# EasyEDA Pro project ProPrj_Hitboard PCB v2_2026-01-15.epro

# Board PCB1
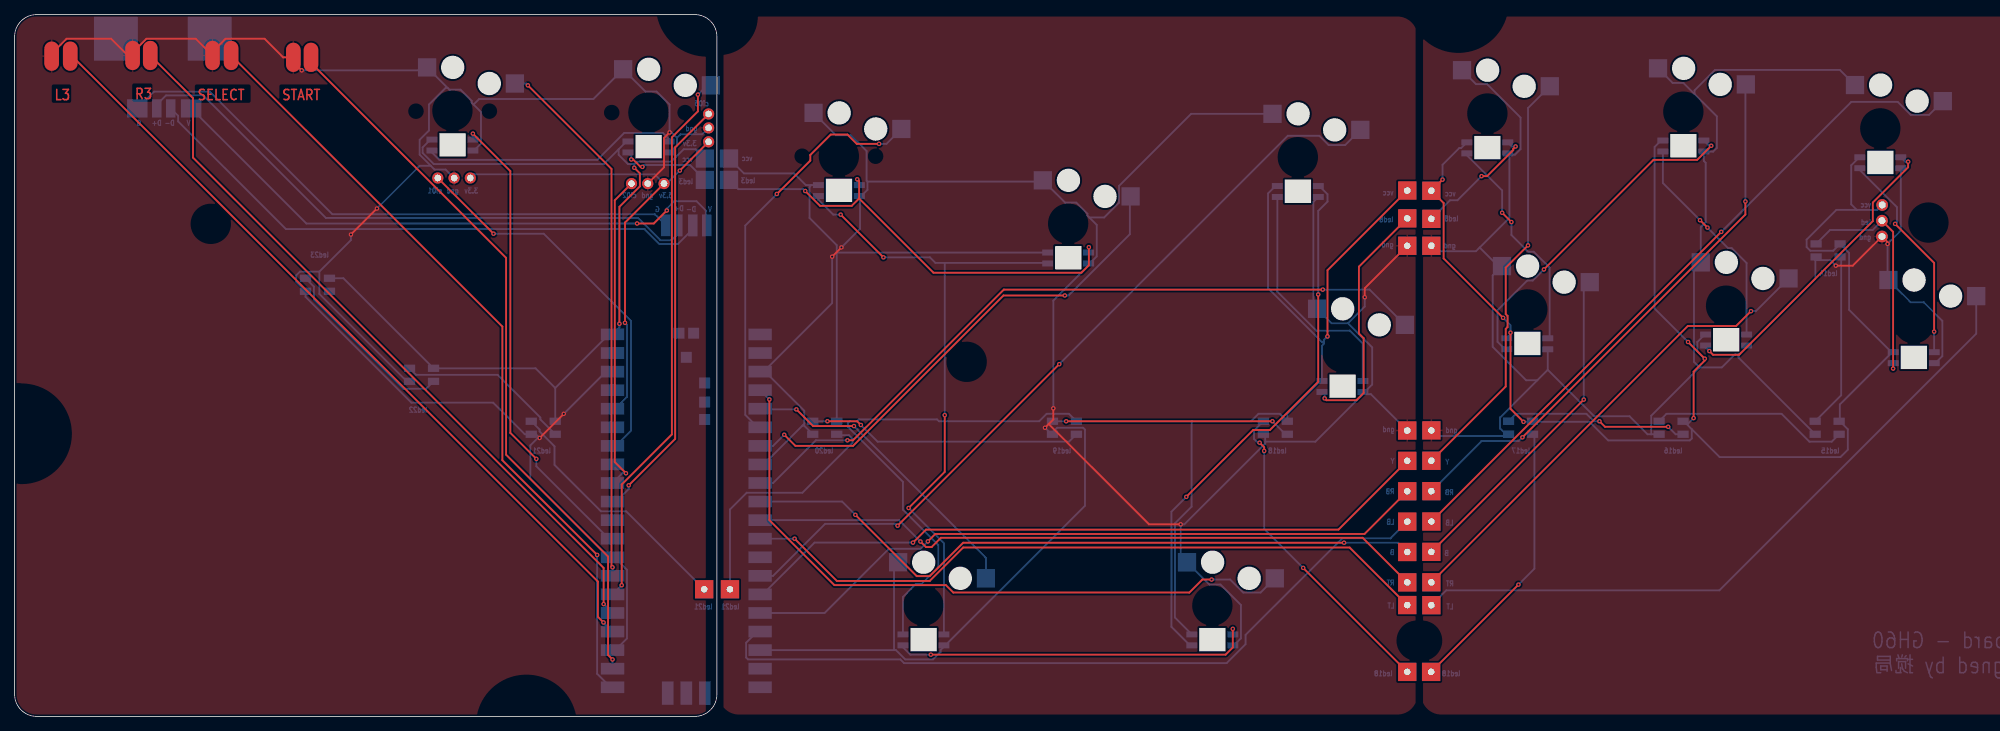
[diagram p0: board, top side]
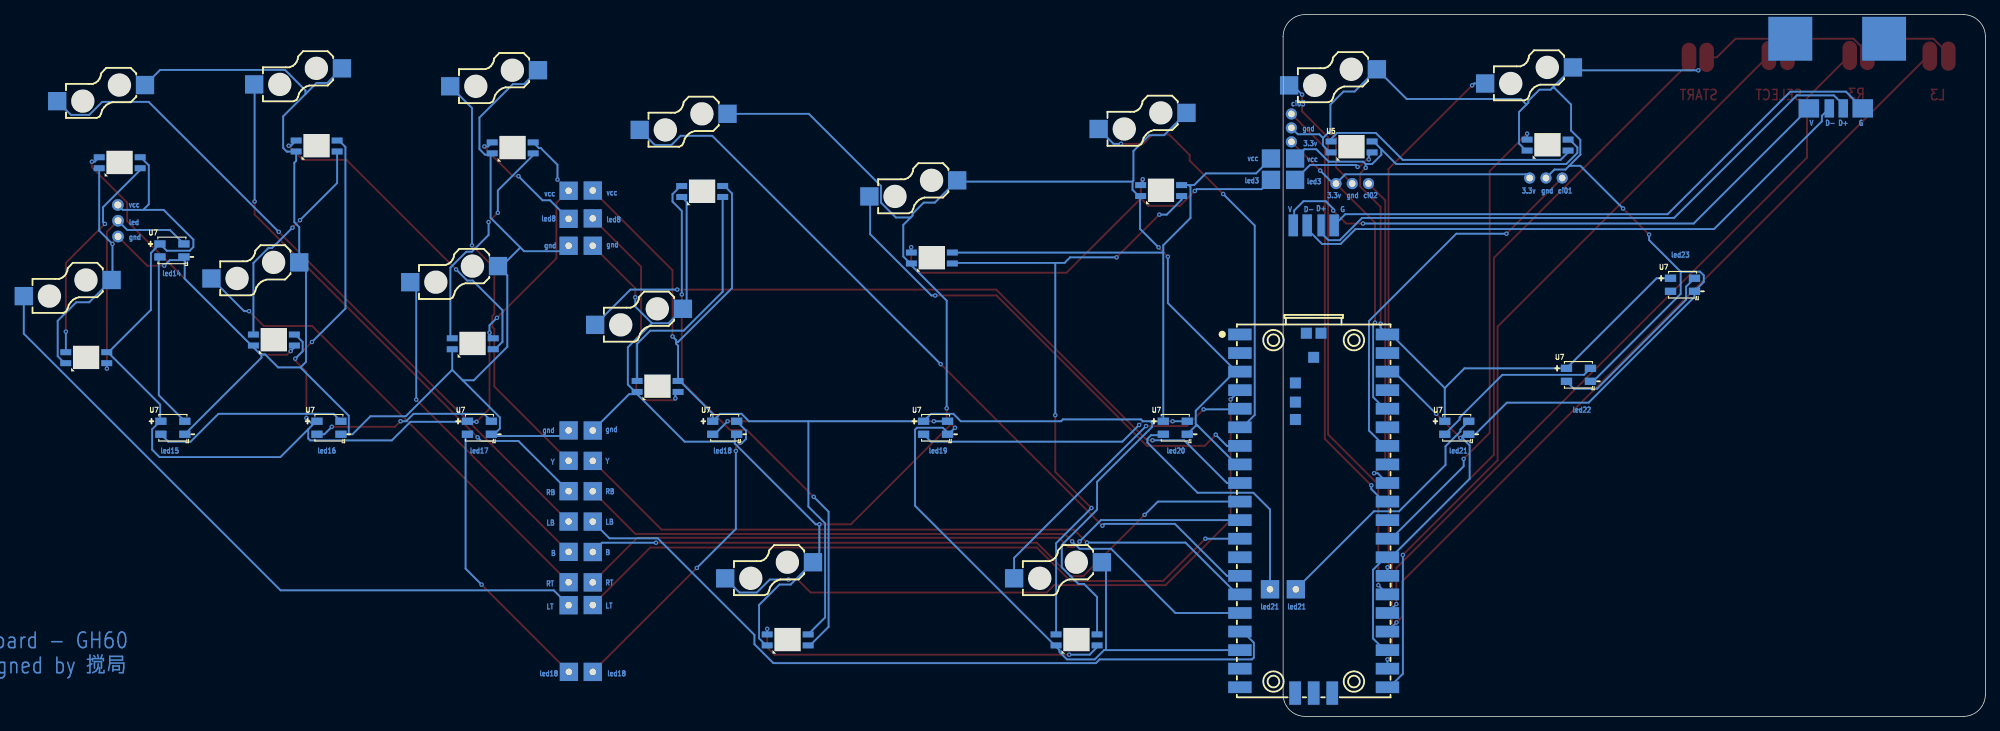
[diagram p1: board, bottom side, seen from below]

Outline 266.25 x 96 mm; copper layers: Top Layer, Bottom Layer. Coordinates in mm from the lower left corner of the outline.
Outline path: 0,93 0,3 arc(0.88,0.88) 3,0 93,0 arc(95.12,0.88) 96,3 96,93 arc(95.12,95.12) 93,96 3,96 arc(0.88,95.12) 0,93
Stack: Top Layer 0.035mm / Dielectric1 1.51mm FR4 er 4.5 / Bottom Layer 0.035mm

## Design rules (mm)
template: JLCPCB Capability(Two Layers Board)
spacing copperThickness1oz (default): track to track 0.102, other pairs 0.152 to 0.3
spacing copperThickness2oz: track to track 0.203, other pairs 0.152 to 0.3
track width copperThickness1oz (default): min 0.127, default 0.254, max 2.54
track width copperThickness2oz: min 0.203, default 0.254, max 2.54
differential pair differentialPair (default): width min 0.127, default 0.254, max 2.54; gap min 0.152, default 0.152
via viaSize (default): diameter min 0.5, default 0.61, max 10; hole min 0.3, default 0.305, max 6.3

## Placement (name value [footprint] x y rotation side)
NOREF  -  [Pad_e68]  193.68 39.12 0 top
NOREF#2  -  [Pad_e301]  94.87 82.41 0 top
NOREF#3  -  [Pad_e299]  94.87 78.6 0 top
NOREF#4  -  [Pad_e13637]  193.68 71.9 0 top
NOREF#5  -  [Pad_e675]  5.06 90.32 0 top
NOREF#6  -  [Pad_e296]  60.07 73.65 0 top
NOREF#7  -  [Pad_e691]  90.81 67.17 180 top
NOREF#8  -  [Pad_e61148]  255.27 65.65 0 top
NOREF#9  -  [Pad_e13607]  190.37 18.33 0 top
NOREF#10  -  [Pad_e13608]  190.37 15.23 0 top
NOREF#11  -  [Pad_e70]  193.68 30.81 0 top
NOREF#12  -  [Pad_e681]  38.1 90.16 0 top
NOREF#13  -  [Pad_e676]  7.6 90.32 0 top
NOREF#14  -  [Pad_e13601]  190.37 68.12 0 top
NOREF#15  -  [Pad_e4875]  193.64 6.08 0 top
NOREF#16  -  [Pad_e4877]  190.37 6.08 0 top
NOREF#17  -  [Pad_e682]  40.51 90.16 0 top
NOREF#18  -  [Pad_e6738]  94.36 73.39 0 top
NOREF#19  -  [Pad_e678]  18.54 90.41 0 top
NOREF#20  -  [Pad_e53994]  26.67 92.7 180 top
NOREF#21  -  [Pad_e679]  27.05 90.41 0 top
NOREF#22  -  [Pad_e694]  94.61 67.17 180 top
NOREF#23  -  [Pad_e61147]  255.27 67.81 0 top
NOREF#24  -  [Pad_e46]  88.77 72.89 0 top
NOREF#25  -  [Pad_e687]  97.66 76.31 0 top
NOREF#26  -  [Pad_e685]  21.34 83.17 180 top
NOREF#27  -  [Pad_e69]  193.68 34.97 0 top
NOREF#28  -  [Pad_e61146]  255.3 69.97 0 top
NOREF#29  -  [Pad_e13603]  190.37 34.95 0 top
NOREF#30  -  [Pad_e6737]  97.66 73.39 0 top
NOREF#31  -  [Pad_e13606]  190.37 22.49 0 top
NOREF#32  -  [Pad_e13636]  193.68 64.38 0 top
NOREF#33  -  [Pad_e684]  19.43 83.17 180 top
NOREF#34  -  [Pad_e680]  29.59 90.41 0 top
NOREF#35  -  [Pad_e297]  57.85 73.65 0 top
NOREF#36  -  [Pad_e300]  94.87 80.51 0 top
NOREF#37  -  [Pad_e677]  16.13 90.41 0 top
NOREF#38  -  [Pad_e693]  92.71 67.17 180 top
NOREF#39  -  [Pad_e294]  86.55 72.89 0 top
NOREF#40  -  [Pad_e683]  16.76 83.17 180 top
NOREF#41  -  [Pad_e72]  193.68 22.5 0 top
NOREF#42  -  [Pad_e13635]  193.68 68.06 0 top
NOREF#43  -  [Pad_e4881]  97.79 17.39 0 top
NOREF#44  -  [Pad_e13605]  190.37 26.64 0 top
NOREF#45  -  [Pad_e71]  193.68 26.66 0 top
NOREF#46  -  [Pad_e4879]  94.26 17.39 0 top
NOREF#47  -  [Pad_e73]  193.68 18.35 0 top
NOREF#48  -  [Pad_e13600]  190.37 71.93 0 top
NOREF#49  -  [Pad_e6736]  94.36 76.31 0 top
NOREF#50  -  [Pad_e53995]  13.84 92.7 180 top
NOREF#51  -  [Pad_e48]  84.33 72.89 0 top
NOREF#52  -  [Pad_e295]  62.29 73.65 0 top
NOREF#53  -  [Pad_e13604]  190.37 30.8 0 top
NOREF#54  -  [Pad_e114539]  190.37 39.1 0 top
NOREF#55  -  [Pad_e689]  89.03 67.17 180 top
NOREF#56  -  [Pad_e74]  193.68 15.21 0 top
NOREF#57  -  [Pad_e13602]  190.37 64.38 0 top
NOREF#58  -  [Pad_e686]  24.13 83.17 180 top
U1  PICO  [COMM-SMD_L51.0-W21.0-P2.54_SC0916]  91.82 27.8 270 bottom
U5  -  [LED-SMD_L3.2-W2.8_YO-WS2812B-3528]  144.02 62.7 180 bottom
U5#2  -  [LED-SMD_L3.2-W2.8_YO-WS2812B-3528]  59.84 78.15 180 bottom
U5#3  -  [LED-SMD_L3.2-W2.8_YO-WS2812B-3528]  86.64 77.9 180 bottom
U5#4  -  [LED-SMD_L3.2-W2.8_YO-WS2812B-3528]  112.68 71.93 180 bottom
U5#5  -  [LED-SMD_L3.2-W2.8_YO-WS2812B-3528]  124.23 10.46 180 bottom
U5#6  -  [LED-SMD_L3.2-W2.8_YO-WS2812B-3528]  163.73 10.46 180 bottom
U5#7  -  [LED-SMD_L3.2-W2.8_YO-WS2812B-3528]  175.41 71.8 180 bottom
U5#8  -  [LED-SMD_L3.2-W2.8_YO-WS2812B-3528]  181.51 45.13 180 bottom
U5#9  -  [LED-SMD_L3.2-W2.8_YO-WS2812B-3528]  201.32 77.77 180 bottom
U5#10  -  [LED-SMD_L3.2-W2.8_YO-WS2812B-3528]  206.78 50.97 180 bottom
U5#11  -  [LED-SMD_L3.2-W2.8_YO-WS2812B-3528]  228.12 78.03 180 bottom
U5#12  -  [LED-SMD_L3.2-W2.8_YO-WS2812B-3528]  233.96 51.48 180 bottom
U5#13  -  [LED-SMD_L3.2-W2.8_YO-WS2812B-3528]  255.04 75.74 180 bottom
U5#14  -  [LED-SMD_L3.2-W2.8_YO-WS2812B-3528]  259.62 49.07 180 bottom
U6  -  [CONN-SMD_HOTPLUGPAKAGE__C9900010116-1]  146.56 72.23 180 bottom
U6#2  -  [CONN-SMD_HOTPLUGPAKAGE__C9900010116-1]  62.38 87.68 180 bottom
U6#3  -  [CONN-SMD_HOTPLUGPAKAGE__C9900010116-1]  89.18 87.42 180 bottom
U6#4  -  [CONN-SMD_HOTPLUGPAKAGE__C9900010116-1]  115.22 81.45 180 bottom
U6#5  -  [CONN-SMD_HOTPLUGPAKAGE__C9900010116-1]  126.77 19.99 180 bottom
U6#6  -  [CONN-SMD_HOTPLUGPAKAGE__C9900010116-1]  166.27 19.99 180 bottom
U6#7  -  [CONN-SMD_HOTPLUGPAKAGE__C9900010116-1]  177.95 81.33 180 bottom
U6#8  -  [CONN-SMD_HOTPLUGPAKAGE__C9900010116-1]  184.05 54.66 180 bottom
U6#9  -  [CONN-SMD_HOTPLUGPAKAGE__C9900010116-1]  203.86 87.3 180 bottom
U6#10  -  [CONN-SMD_HOTPLUGPAKAGE__C9900010116-1]  209.32 60.5 180 bottom
U6#11  -  [CONN-SMD_HOTPLUGPAKAGE__C9900010116-1]  230.66 87.55 180 bottom
U6#12  -  [CONN-SMD_HOTPLUGPAKAGE__C9900010116-1]  236.5 61.01 180 bottom
U6#13  -  [CONN-SMD_HOTPLUGPAKAGE__C9900010116-1]  257.58 85.27 180 bottom
U6#14  -  [CONN-SMD_HOTPLUGPAKAGE__C9900010116-1]  262.16 58.59 180 bottom
U7  -  [LED-SMD_4P-L3.5-W3.5-TL_WS2812B]  72.26 39.48 180 bottom
U7#2  -  [LED-SMD_4P-L3.5-W3.5-TL_WS2812B]  247.9 63.74 180 bottom
U7#3  -  [LED-SMD_4P-L3.5-W3.5-TL_WS2812B]  247.78 39.48 180 bottom
U7#4  -  [LED-SMD_4P-L3.5-W3.5-TL_WS2812B]  226.44 39.48 180 bottom
U7#5  -  [LED-SMD_4P-L3.5-W3.5-TL_WS2812B]  205.87 39.48 180 bottom
U7#6  -  [LED-SMD_4P-L3.5-W3.5-TL_WS2812B]  172.34 39.48 180 bottom
U7#7  -  [LED-SMD_4P-L3.5-W3.5-TL_WS2812B]  143.51 39.48 180 bottom
U7#8  -  [LED-SMD_4P-L3.5-W3.5-TL_WS2812B]  110.74 39.48 180 bottom
U7#9  -  [LED-SMD_4P-L3.5-W3.5-TL_WS2812B]  55.63 46.72 180 bottom
U7#10  -  [LED-SMD_4P-L3.5-W3.5-TL_WS2812B]  41.4 59.04 180 bottom

## Footprints (pads in the part's own frame, mm; a bottom-side part is the same pattern mirrored in y, then rotated)
COMM-SMD_L51.0-W21.0-P2.54_SC0916
  rect 1.6x3.2 smd: 1(-24.445,-10.088) 2(-21.905,-10.088) 3(-19.365,-10.088) 4(-16.825,-10.088) 5(-14.285,-10.088) 6(-11.745,-10.088) 7(-9.205,-10.088) 8(-6.665,-10.088) 9(-4.125,-10.088) 10(-1.585,-10.088) 11(0.955,-10.088) 12(3.495,-10.088) 13(6.035,-10.088) 14(8.575,-10.088) 15(11.115,-10.088) 16(13.655,-10.088) 17(16.195,-10.088) 18(18.735,-10.088) 19(21.275,-10.088) 20(23.815,-10.088) 21(23.815,10.088) 22(21.275,10.088) 23(18.735,10.088) 24(16.195,10.088) 25(13.655,10.088) 26(11.115,10.088) 27(8.575,10.088) 28(6.035,10.088) 29(3.495,10.088) 30(0.955,10.088) 31(-1.585,10.088) 32(-4.125,10.088) 33(-6.665,10.088) 34(-9.205,10.088) 35(-11.745,10.088) 36(-14.285,10.088) 37(-16.825,10.088) 38(-19.365,10.088) 39(-21.905,10.088) 40(-24.445,10.088)
  rect 3.2x1.6 smd: 41(24.615,-2.54) 42(24.615,0) 43(24.615,2.54)
  rect 1.5x1.5 smd: TP1(-21.315,0) TP2(-24.615,1) TP3(-24.615,-1) TP4(-17.815,-2.5) TP5(-15.188,-2.5) TP6(-12.815,-2.5)
CONN-SMD_HOTPLUGPAKAGE__C9900010116-1
  rect 2.5x2.5 smd: 1(-6,-1.1) 2(6,1.1)
LED-SMD_4P-L3.5-W3.5-TL_WS2812B
  rect 1.545x0.997 smd: 1(-1.637,0.89) 2(-1.637,-0.89) 3(1.637,-0.89) 4(1.637,0.89)
LED-SMD_L3.2-W2.8_YO-WS2812B-3528
  rect 1.5x0.82 smd: 1(2.8,0.75) 2(2.8,-0.75) 3(-2.8,-0.75) 4(-2.8,0.75)
Pad_e46
  round 1.524 hole 0.914: 1(0,0)
Pad_e48
  round 1.524 hole 0.914: 1(0,0)
Pad_e68
  rect 2.5x2.5 hole 0.9: PTH(0,0)
Pad_e69
  rect 2.5x2.5 hole 0.9: PTH(0,0)
Pad_e70
  rect 2.5x2.5 hole 0.9: PTH(0,0)
Pad_e71
  rect 2.5x2.5 hole 0.9: PTH(0,0)
Pad_e72
  rect 2.5x2.5 hole 0.9: PTH(0,0)
Pad_e73
  rect 2.5x2.5 hole 0.9: PTH(0,0)
Pad_e74
  rect 2.5x2.5 hole 0.9: PTH(0,0)
Pad_e294
  round 1.524 hole 0.914: 1(0,0)
Pad_e295
  round 1.524 hole 0.914: 1(0,0)
Pad_e296
  round 1.524 hole 0.914: 1(0,0)
Pad_e297
  round 1.524 hole 0.914: 1(0,0)
Pad_e299
  round 1.524 hole 0.914: 1(0,0)
Pad_e300
  round 1.524 hole 0.914: 1(0,0)
Pad_e301
  round 1.524 hole 0.914: 1(0,0)
Pad_e675
  oval 2x4 smd: 1(0,0)
Pad_e676
  oval 2x4 smd: 1(0,0)
Pad_e677
  oval 2x4 smd: 1(0,0)
Pad_e678
  oval 2x4 smd: 1(0,0)
Pad_e679
  oval 2x4 smd: 1(0,0)
Pad_e680
  oval 2x4 smd: 1(0,0)
Pad_e681
  oval 2x4 smd: 1(0,0)
Pad_e682
  oval 2x4 smd: 1(0,0)
Pad_e683
  rect 2.8x2.5 smd far side: PTH(0,0)
Pad_e684
  rect 1.3x2.5 smd far side: PTH(0,0)
Pad_e685
  rect 1.3x2.5 smd far side: PTH(0,0)
Pad_e686
  rect 2.8x2.5 smd far side: PTH(0,0)
Pad_e687
  rect 2.5x2.5 smd far side: PTH(0,0)
Pad_e689
  rect 1.3x3 smd far side: PTH(0,0)
Pad_e691
  rect 1x3 smd far side: PTH(0,0)
Pad_e693
  rect 1.3x3 smd far side: PTH(0,0)
Pad_e694
  rect 1.3x3 smd far side: PTH(0,0)
Pad_e4875
  rect 2.5x2.5 hole 0.9: PTH(0,0)
Pad_e4877
  rect 2.5x2.5 hole 0.9: PTH(0,0)
Pad_e4879
  rect 2.5x2.5 hole 0.9: PTH(0,0)
Pad_e4881
  rect 2.5x2.5 hole 0.9: PTH(0,0)
Pad_e6736
  rect 2.5x2.5 smd far side: PTH(0,0)
Pad_e6737
  rect 2.5x2.5 smd far side: PTH(0,0)
Pad_e6738
  rect 2.5x2.5 smd far side: PTH(0,0)
Pad_e13600
  rect 2.5x2.5 hole 0.9: PTH(0,0)
Pad_e13601
  rect 2.5x2.5 hole 0.9: PTH(0,0)
Pad_e13602
  rect 2.5x2.5 hole 0.9: PTH(0,0)
Pad_e13603
  rect 2.5x2.5 hole 0.9: PTH(0,0)
Pad_e13604
  rect 2.5x2.5 hole 0.9: PTH(0,0)
Pad_e13605
  rect 2.5x2.5 hole 0.9: PTH(0,0)
Pad_e13606
  rect 2.5x2.5 hole 0.9: PTH(0,0)
Pad_e13607
  rect 2.5x2.5 hole 0.9: PTH(0,0)
Pad_e13608
  rect 2.5x2.5 hole 0.9: PTH(0,0)
Pad_e13635
  rect 2.5x2.5 hole 0.9: PTH(0,0)
Pad_e13636
  rect 2.5x2.5 hole 0.9: PTH(0,0)
Pad_e13637
  rect 2.5x2.5 hole 0.9: PTH(0,0)
Pad_e53994
  rect 6x6 smd far side: PTH(0,0)
Pad_e53995
  rect 6x6 smd far side: PTH(0,0)
Pad_e61146
  round 1.6 hole 0.96: PTH(0,0)
Pad_e61147
  round 1.6 hole 0.96: PTH(0,0)
Pad_e61148
  round 1.6 hole 0.96: PTH(0,0)
Pad_e114539
  rect 2.5x2.5 hole 0.9: PTH(0,0)

## Nets
3V3: NOREF#3.1 NOREF#24.1 NOREF#52.1 U1.36
GND: NOREF.PTH NOREF#5.1 NOREF#6.1 NOREF#8.PTH NOREF#12.1 NOREF#21.1 NOREF#32.PTH NOREF#36.1 NOREF#37.1 NOREF#39.1 NOREF#54.PTH NOREF#57.PTH U1.3 U1.8 U1.18 U1.23 U1.28 U1.38 U5.3 U5#2.3 U5#3.3 U5#4.3 U5#5.3 U5#6.3 U5#7.3 U5#8.3 U5#9.3 U5#10.3 U5#11.3 U5#12.3 U5#13.3 U5#14.3 U6.2 U6#2.2 U6#3.2 U6#4.2 U6#5.2 U6#6.2 U6#7.2 U6#8.2 U6#9.2 U6#10.2 U6#11.2 U6#12.2 U6#13.2 U6#14.2 U7.3 U7#2.3 U7#3.3 U7#4.3 U7#5.3 U7#6.3 U7#7.3 U7#8.3 U7#9.3 U7#10.3
VCC: NOREF#4.PTH NOREF#25.PTH NOREF#28.PTH NOREF#48.PTH NOREF#49.PTH U1.40 U5.1 U5#2.1 U5#3.1 U5#4.1 U5#5.1 U5#6.1 U5#7.1 U5#8.1 U5#9.1 U5#10.1 U5#11.1 U5#12.1 U5#13.1 U5#14.1 U7.1 U7#2.1 U7#3.1 U7#4.1 U7#5.1 U7#6.1 U7#7.1 U7#8.1 U7#9.1 U7#10.1
2: U5#2.2 U5#3.4
3: NOREF#18.PTH NOREF#30.PTH U5.4 U5#3.2 U5#4.4
4: U5.2 U5#4.2 U5#5.4
5: U5#5.2 U5#6.4
6: U5#6.2 U5#7.4
7: U5#7.2 U5#8.4
8: NOREF#14.PTH NOREF#42.PTH U5#8.2 U5#9.4
9: U5#9.2 U5#10.4
10: U5#10.2 U5#11.4
11: U5#11.2 U5#12.4
12: U5#12.2 U5#13.4
13: U5#13.2 U5#14.4
14: NOREF#23.PTH U5#14.2 U7#2.4
15: U7#2.2 U7#3.4
16: U7#3.2 U7#4.4
17: U7#4.2 U7#5.4
18: NOREF#15.PTH NOREF#16.PTH U7#5.2 U7#6.4
19: U7#6.2 U7#7.4
20: U7#7.2 U7#8.4
21: NOREF#43.PTH NOREF#46.PTH U7.4 U7#8.2
22: U7.2 U7#9.4
23: U7#9.2 U7#10.4
24: U7#10.2
A: U1.9 U6#8.1
B: NOREF#31.PTH NOREF#41.PTH U1.10 U6#10.1
BUTTON1: U1.5 U6#5.1
BUTTON2: U1.7 U6.1
D+: NOREF#7.PTH NOREF#33.PTH
D-: NOREF#26.PTH NOREF#38.PTH
DOWN: U1.26 U6#3.1
G: NOREF#40.PTH NOREF#55.PTH
L3: NOREF#13.1 U1.24
LB: NOREF#44.PTH NOREF#45.PTH U1.17 U6#13.1
LED1: U1.29 U5#2.4
LEFT: U1.27 U6#2.1
LINEBUTTON01: NOREF#35.1 U1.34
LINEBUTTON02: NOREF#51.1 U1.32
LINEBUTTON03: NOREF#2.1 U1.31
LT: NOREF#10.PTH NOREF#56.PTH U1.12 U6#14.1
R3: NOREF#19.1 U1.25
RB: NOREF#11.PTH NOREF#53.PTH U1.16 U6#11.1
RIGHT: U1.6 U6#4.1
RT: NOREF#9.PTH NOREF#47.PTH U1.11 U6#12.1
SELECT: NOREF#34.1 U1.21
START: NOREF#17.1 U1.22
UP: U1.4 U6#6.1
V: NOREF#22.PTH NOREF#58.PTH
X: U1.14 U6#7.1
Y: NOREF#27.PTH NOREF#29.PTH U1.15 U6#9.1

Pads without a net: NOREF#20 PTH; NOREF#50 PTH; U1 1 2 13 19 20 30 33 35 37 39 41 42 43 TP1 TP2 TP3 TP4 TP5 TP6

## Via types
v1: diameter 0.61, hole 0.305, Top Layer to Bottom Layer, 102 vias

## Routing (per net, layer and track width the routed paths; a pad name or vN(x,y) marks a point on that pad's centre or on a via; arc(x,y) is an arc through that point)
3V3: length 69.8
  Top Layer w0.254: NOREF#24.1 83.44,67.55 v1(83.44,53.84) ; v1(90.93,74.66) NOREF#3.1
  Bottom Layer w0.254: v1(83.44,53.84) 83.69,53.58 83.69,43.68 82.1,42.09 U1.36 ; NOREF#52.1 62.8,74.16 87.5,74.16 NOREF#24.1 89.15,72.89 v1(90.93,74.66)
GND: length 937.5
  Top Layer w0.254: v1(184.56,57.34) 184.56,58.57 NOREF#57.PTH ; v1(49.53,69.47) v1(45.97,65.92) ; 141.36,39.99 155.08,26.28 v1(159.4,26.28) ; 141.36,39.99 v1(140.86,39.48) ; 141.36,39.99 141.99,40.62 v1(141.99,42.14) ; v1(256.03,64.63) 256.03,64.89 NOREF#8.PTH 251.28,61.66 v1(248.95,61.66) ; NOREF#39.1 88.77,75.11 88.77,79.13 v1(89.53,79.89) ; 37.97,90.16 36.7,90.16 34.16,92.7 28.83,92.7 27.05,90.92 NOREF#21.1 24.77,92.7 18.02,92.7 15.98,90.67 15.98,90.41 ; 37.97,90.16 37.97,89.65 v1(39.24,88.38) ; 37.97,90.16 NOREF#12.1 ; NOREF#5.1 5.06,90.67 7.09,92.7 13.19,92.7 15.48,90.41 15.98,90.41 ; 15.98,90.41 NOREF#37.1 ; v1(71.77,38.09) v1(75.07,41.39) ; v1(113.03,64.16) v1(111.76,62.89)
  Bottom Layer w0.254: 229.65,85.13 228.13,86.66 226.65,86.66 U6#11.2 ; 229.65,85.13 232.7,82.08 232.7,77.77 232.19,77.26 230.92,77.26 ; 229.65,85.13 229.65,85.64 232.44,88.43 249.51,88.43 U6#13.2 ; 203.84,38.61 203.58,38.36 194.44,38.36 NOREF.PTH ; 203.84,38.61 204.21,38.61 U7#5.3 ; 203.84,38.61 203.07,39.37 203.07,40.9 208.15,45.98 ; 230.34,47.74 229.57,48.5 229.57,61.18 U6#12.2 230.5,66.93 231.17,67.61 231.17,75.73 230.92,75.99 230.92,77.26 ; 230.34,47.74 223.73,41.14 223.73,38.59 ; 230.34,47.74 233.38,47.74 235.16,49.52 235.67,49.52 ; 90.55,79.13 91.06,79.63 94,79.63 NOREF#36.1 ; 90.55,79.13 90.55,78.11 89.59,77.15 U5#3.3 ; 90.55,79.13 89.79,79.89 ; 102.1,47.14 102.36,47.39 102.61,47.39 111.76,56.54 v1(111.76,62.89) ; 102.1,47.14 101.93,47.14 U1.3 ; 102.1,47.14 102.61,47.14 107.95,41.81 107.95,40.03 107.69,39.77 ; U6#4.2 112.26,79.51 114.3,79.51 116.46,77.34 116.46,73.28 116.58,73.16 ; 141.75,38.72 141.62,38.72 v1(140.86,39.48) ; 141.75,38.72 142.51,39.48 146.06,39.48 146.32,39.23 146.32,28.82 127.01,9.51 ; 141.75,38.72 U7#7.3 ; 184.31,44.08 177.81,37.58 170.96,37.58 ; 184.31,44.08 185.4,44.08 NOREF#54.PTH ; 184.31,44.08 U5#8.3 184.56,44.38 185.58,45.4 185.58,50.48 182.28,53.78 ; 204.34,76.84 204.3,76.84 U5#9.3 ; 204.34,76.84 204.34,68.2 200.28,64.14 ; 204.34,76.84 205.1,76.84 205.86,77.6 205.86,81.92 201.29,86.49 199.77,86.49 U6#9.2 ; 120.22,9.07 120.22,20.53 U6#5.2 ; 120.22,9.07 120.47,9.07 121.74,7.8 125.55,7.8 126.57,8.81 126.57,9.07 127.01,9.51 ; 120.22,9.07 U1.18 ; v1(248.95,61.66) 248.19,62.42 246.16,62.42 ; U1.23 81.8,9.13 82.18,9.13 83.71,10.66 83.71,20.05 81.93,21.83 81.67,21.83 ; 246.16,62.42 246.16,59.88 237.02,50.73 U5#12.3 236.69,50.66 236.69,50.4 235.8,49.52 235.67,49.52 ; 246.16,62.42 246.16,62.75 U7#2.3 ; 223.73,38.59 U7#4.3 ; 223.73,38.59 223.22,38.59 220.76,41.06 215.93,41.06 209.58,47.41 ; 115.57,71.27 115.82,71.27 116.58,72.03 116.58,73.16 ; 115.57,71.27 115.57,66.7 v1(113.03,64.16) ; 115.57,71.27 U5#4.3 ; 200.28,64.14 199.77,63.63 194.42,63.63 NOREF#32.PTH ; 200.28,64.14 202.82,61.6 U6#10.2 202.06,60.33 202.06,50.55 206.63,45.98 208.15,45.98 ; 116.58,73.16 140.38,73.16 U6.2 143.61,70.28 145.13,70.28 146.65,68.76 146.65,68.5 146.91,68.25 ; v1(49.53,69.47) 55.37,75.32 56.89,75.32 ; 62.73,83.7 62.48,83.95 62.48,84.21 60.96,85.73 59.43,85.73 59.18,85.98 ; 62.73,83.7 63.5,84.46 79.12,84.46 U6#3.2 86.23,85.48 87.75,85.48 89.53,83.7 89.53,80.14 89.79,79.89 ; 62.73,83.7 63.75,82.68 63.75,78.36 62.79,77.4 U5#2.3 ; U6#7.2 160.83,82.43 150.97,72.57 150.97,70.28 148.94,68.25 146.91,68.25 ; 81.67,21.83 81.17,21.83 70.5,32.5 70.5,37.07 71.51,38.09 v1(71.77,38.09) 71.26,38.59 U7.3 69.74,38.59 65.42,42.91 54.24,42.91 39.76,57.39 U7#10.3 38.49,59.42 38.49,60.33 39,60.84 41.65,60.84 ; 81.67,21.83 U1.28 ; 146.91,68.25 147.92,67.23 147.92,62.92 146.96,61.95 U5.3 146.82,61.7 141.99,56.88 v1(141.99,42.14) ; 230.92,77.26 U5#11.3 ; U5#6.3 166.68,9.71 167.64,10.67 167.64,15.25 164.84,18.04 163.32,18.04 U6#6.2 159.4,21.96 v1(159.4,26.28) 159.91,26.28 170.96,37.33 170.96,37.58 ; 235.67,49.52 235.67,49.07 U7#3.3 ; v1(184.56,57.34) 184.56,56.07 182.28,53.78 ; U5#14.3 262.56,48.32 263.52,49.28 263.52,54.11 260.98,56.65 259.2,56.65 U6#14.2 256.03,59.82 v1(256.03,64.63) 257.84,66.44 U5#13.3 ; 59.18,85.98 58.92,85.98 56.64,83.7 56.64,80.14 55.37,78.87 55.37,76.84 56.89,75.32 ; 59.18,85.98 U6#2.2 55.99,88.38 v1(39.24,88.38) ; 127.01,9.51 127.01,9.69 U5#5.3 ; 107.69,39.77 102.39,34.47 U1.8 ; 107.69,39.77 107.93,39.77 U7#8.3 ; 41.65,60.84 41.65,57.79 53.59,45.85 53.97,45.85 U7#9.3 ; 41.65,60.84 45.97,65.16 v1(45.97,65.92) ; 56.89,75.32 57.4,74.81 58.91,74.81 NOREF#6.1 ; 182.28,53.78 180.03,53.78 U6#8.2 177.54,56.27 177.54,70.38 U5#7.3 ; 208.15,45.98 209.58,47.41 ; 89.79,79.89 v1(89.53,79.89) ; v1(75.07,41.39) 80.85,47.17 U1.38 ; 170.96,37.58 170.96,38.34 U7#6.3 ; 209.58,47.41 U5#10.3
VCC: length 602.3
  Top Layer w0.254: NOREF#48.PTH 179.47,61.03 v1(179.47,51.98) ; v1(206.27,40.3) 204.49,42.07 v1(204.49,52.49) ; v1(84.71,75.05) 85.47,74.28 85.47,72.5 82.68,69.71 v1(82.68,53.71) ; v1(229.52,40.8) 229.52,47.15 231.05,48.68 v1(231.05,48.93) v1(228.76,51.22) ; v1(203.48,54.52) 195.35,62.65 195.35,70.23 NOREF#4.PTH v1(195.2,73.43)
  Bottom Layer w0.254: 251.83,69.29 249.03,69.29 244.97,65.22 244.97,64.21 245.48,63.7 248.61,63.7 U7#2.1 250.78,63.39 250.78,55.61 256.62,49.77 ; 251.83,69.29 251.07,70.05 251.07,75.38 252.17,76.49 U5#13.1 ; 251.83,69.29 254.62,69.29 NOREF#28.PTH ; 228.51,40.04 228.17,40.38 U7#4.1 ; 228.51,40.04 229.27,39.28 ; 228.51,40.04 228.76,40.04 v1(229.52,40.8) ; v1(203.48,54.52) 204.49,53.5 v1(204.49,52.49) 204.49,52.23 U5#10.1 ; 256.62,49.77 U5#14.1 ; 256.62,49.77 249.51,42.66 249.51,40.38 ; U5#12.1 231.05,52.23 230.03,51.22 230.03,49.95 v1(231.05,48.93) ; NOREF#25.PTH 99.69,74.28 106.55,74.28 108.16,72.68 108.92,72.68 ; U5#5.1 121.43,16.34 123.21,18.12 123.97,18.12 126.26,20.4 126.26,23.45 121.43,28.28 121.43,32.08 113.91,39.61 113.91,40.12 114.16,40.38 ; 207.42,40.3 215.3,40.3 217.84,37.75 229.01,37.75 229.27,38.01 229.27,39.28 ; 207.42,40.3 v1(206.27,40.3) ; 207.42,40.3 U7#5.1 ; 229.27,39.28 233.08,35.47 249.59,35.47 250.6,36.48 250.6,39.28 249.51,40.38 ; 108.92,72.68 U5#4.1 ; 108.92,72.68 108.66,72.43 108.66,68.18 112.38,64.46 112.38,63.44 ; U5#2.1 56.84,78.9 55.77,77.84 55.77,77.08 57.3,75.55 80.54,75.55 82.57,77.58 ; 249.51,40.38 U7#3.1 ; 178.96,51.22 178.96,51.47 v1(179.47,51.98) ; 178.96,51.22 178.71,51.22 171.34,58.58 171.34,71.54 172.36,72.55 U5#7.1 ; 178.96,51.22 178.96,50.96 178.71,50.71 U5#8.1 178.47,45.88 173.98,41.39 U7#6.1 172.96,41.39 170.04,41.39 169.02,40.38 160.9,40.38 ; 160.9,40.38 160.9,28.69 158.61,26.41 158.61,13.53 U5#6.1 ; 160.9,40.38 U7#7.1 144.13,41.39 141.08,41.39 140.07,40.38 126.35,40.38 126.1,40.63 115.43,40.63 115.18,40.38 114.16,40.38 ; 112.38,63.44 141.21,63.44 U5.1 ; 112.38,63.44 U7#8.1 114.16,40.38 ; 82.57,77.58 82.57,76.82 83.84,75.55 84.71,75.55 ; 82.57,77.58 83.64,78.65 U5#3.1 ; 73.9,44.92 U7.1 ; 73.9,44.92 81.23,52.25 U1.40 82.68,53.19 v1(82.68,53.71) ; 73.9,44.92 71.21,47.61 U7#9.1 44.94,59.93 43.04,59.93 ; v1(195.2,73.43) 195.2,75.46 197.49,77.74 197.74,77.74 U5#9.1 ; 84.71,75.55 85.04,75.88 89.76,75.88 91.46,77.58 93.09,77.58 NOREF#49.PTH ; 84.71,75.55 v1(84.71,75.05) ; v1(228.76,51.22) 224.19,55.79 224.19,77.9 225.07,78.78 U5#11.1
2: length 35.3
  Bottom Layer w0.254: U5#2.2 57.04,77.15 58.06,76.13 79.65,76.13 83.33,79.82 88.62,79.82 89.44,78.99 U5#3.4
3: length 75.2
  Top Layer w0.254: v1(84.29,76.19) 84.55,76.19 85.56,75.17 v1(85.82,75.17) ; 115.44,70.85 115.44,73.22 v1(115.19,73.48) ; 115.44,70.85 114.43,69.84 110.11,69.84 v1(108.08,71.87) ; 115.44,70.85 125.6,60.69 145.84,60.69 146.85,61.71 v1(146.85,64.18)
  Bottom Layer w0.254: U5#4.4 115.19,72.97 v1(115.19,73.48) ; NOREF#30.PTH 98.93,72.12 107.82,72.12 v1(108.08,71.87) ; v1(146.85,64.18) 146.85,63.49 U5.4 ; NOREF#18.PTH 92.33,75.43 86.07,75.43 v1(85.82,75.17) ; U5#3.2 84.29,76.7 v1(84.29,76.19)
4: length 90.3
  Top Layer w0.254: v1(127.15,41.21) 127.15,33.45 v1(122.21,28.51) ; v1(112.92,68.64) v1(118.77,62.8)
  Bottom Layer w0.254: 127.15,62.04 125.88,62.04 125.12,62.8 v1(118.77,62.8) ; 127.15,62.04 v1(127.15,41.21) ; 127.15,62.04 141.14,62.04 U5.2 ; v1(122.21,28.51) 127.03,23.68 U5#5.4 ; U5#4.2 109.88,70.67 111.91,68.64 v1(112.92,68.64)
5: length 49.5
  Top Layer w0.254: v1(166.53,11.97) 166.53,9.43 165.54,8.44 v1(125.24,8.44)
  Bottom Layer w0.254: v1(125.24,8.44) 122.45,8.44 121.43,9.46 U5#5.2 ; v1(166.53,11.97) U5#6.4
6: length 74.9
  Top Layer w0.254: v1(160.17,30.03) 169.31,39.18 171.6,39.18 178.2,45.78 v1(178.2,57.72)
  Bottom Layer w0.254: v1(178.2,57.72) 178.2,69.15 179.47,70.42 179.47,71.43 178.57,72.33 178.44,72.33 U5#7.4 ; U5#6.2 160.68,9.71 158.14,12.25 158.14,28 v1(160.17,30.03)
7: length 32.7
  Bottom Layer w0.254: U5#8.4 184.3,45.89 184.3,50.99 182.52,52.77 177.95,52.77 172.61,58.1 U5#7.2
8: length 50.8
  Top Layer w0.254: v1(179.08,43.5) 179.34,43.25 183.42,43.25 184.42,44.25 184.42,51.73 183.77,52.38 183.77,61.52 NOREF#14.PTH ; v1(200.53,73.9) 201.29,73.9 204.87,77.48 204.87,77.65 v1(205.19,77.97)
  Bottom Layer w0.254: U5#8.2 179.08,44.01 v1(179.08,43.5) ; NOREF#42.PTH 196.22,70.6 197.23,70.6 v1(200.53,73.9) ; U5#9.4 204.68,77.97 v1(205.19,77.97)
9: length 30.5
  Top Layer w0.254: v1(203.35,68.89) v1(204.62,67.62)
  Bottom Layer w0.254: v1(203.35,68.89) 203.35,71.94 198.52,76.77 U5#9.2 ; U5#10.4 209.84,51.98 209.84,61.39 207.67,63.56 206.9,63.56 204.62,65.85 v1(204.62,67.62)
10: length 45.9
  Top Layer w0.254: v1(209.06,61.15) 224.05,76.13 230.01,76.13 v1(231.94,78.06)
  Bottom Layer w0.254: U5#10.2 203.73,50.22 202.71,51.24 202.71,55.56 206.78,59.62 207.54,59.62 v1(209.06,61.15) ; U5#11.4 231.63,78.06 v1(231.94,78.06)
11: length 30.1
  Top Layer w0.254: v1(230.4,67.88) v1(231.42,66.86)
  Bottom Layer w0.254: v1(230.4,67.88) 225.32,72.96 U5#11.2 ; v1(231.42,66.86) 234.21,64.07 234.72,64.07 236.76,62.02 U5#12.4
12: length 42.5
  Top Layer w0.254: v1(231.67,49.97) 232.18,49.46 235.73,49.46 254.02,67.75 254.02,70.29 258.85,75.12 v1(258.85,75.88)
  Bottom Layer w0.254: U5#13.4 258.45,75.88 v1(258.85,75.88) ; v1(231.67,49.97) 231.16,50.48 U5#12.2
13: length 29.6
  Top Layer w0.254: v1(257.07,67.37) 262.4,62.04 v1(262.4,52.64)
  Bottom Layer w0.254: v1(257.07,67.37) 257.32,67.62 257.32,69.66 252.24,74.74 U5#13.2 ; U5#14.4 262.4,49.83 v1(262.4,52.64)
14: length 31.9
  Top Layer w0.254: v1(256.79,47.58) 256.79,66.28 NOREF#23.PTH
  Bottom Layer w0.254: U5#14.2 256.79,48.3 v1(256.79,47.58) ; U7#2.4 248.17,66.54 254,66.54 NOREF#23.PTH
15: length 24
  Bottom Layer w0.254: U7#2.2 249.7,62.7 249.7,43.93 U7#3.4
16: length 27
  Bottom Layer w0.254: U7#3.2 248.4,37.58 245.35,37.58 241.54,41.39 225.82,41.39 U7#4.4
17: length 25.4
  Top Layer w0.254: v1(226.05,39.61) 217.41,39.61 v1(216.65,40.37)
  Bottom Layer w0.254: v1(216.65,40.37) 215.89,40.37 214.87,41.39 205.24,41.39 U7#5.4 ; U7#4.2 227.06,38.59 v1(226.05,39.61)
18: length 82.1
  Top Layer w0.254: v1(170.81,36.31) 170.81,36.82 v1(170.19,37.44) ; NOREF#16.PTH v1(176.15,20.31) ; NOREF#15.PTH v1(205.57,18.02)
  Bottom Layer w0.254: U7#5.2 207.76,38.34 207.76,20.21 v1(205.57,18.02) ; v1(170.81,36.31) 170.81,25.64 v1(176.15,20.31) ; v1(170.19,37.44) 169.94,37.44 169.43,37.95 169.43,39.11 U7#6.4
19: length 32.8
  Top Layer w0.254: v1(171.94,40.37) v1(143.75,40.37)
  Bottom Layer w0.254: v1(143.75,40.37) 141.87,40.37 ; v1(171.94,40.37) 173.72,38.59 U7#6.2
20: length 37.6
  Top Layer w0.254: v1(111.11,40.37) 115.18,40.37 v1(115.68,39.86)
  Bottom Layer w0.254: U7#7.2 144.13,37.58 117.97,37.58 v1(115.68,39.86) ; v1(111.11,40.37) 109.11,40.37
21: length 69.2
  Bottom Layer w0.254: U7#8.2 112.51,38.47 114.05,38.47 114.55,37.96 114.55,37.45 107.7,30.59 100.08,30.59 97.79,28.31 NOREF#43.PTH ; NOREF#46.PTH 83.59,28.05 80.15,28.05 73.8,34.41 73.8,36.94 71.77,38.98 71.77,39.23 U7.4
22: length 23.8
  Bottom Layer w0.254: U7#9.4 54.88,46.72 66.03,46.72 71.87,40.88 71.87,40.63 U7.2
23: length 25.2
  Bottom Layer w0.254: U7#9.2 56.25,44.82 53.1,44.82 40.91,57.01 40.91,58.79 39.76,59.93
A: length 101.1
  Top Layer w0.254: v1(113.85,37.77) 114.61,37.77 135.22,58.38 v1(178.83,58.38)
  Bottom Layer w0.254: v1(178.83,58.38) 185.22,58.38 U6#8.1 ; U1.9 103.69,31.93 109.53,37.77 v1(113.85,37.77)
B: length 141
  Top Layer w0.254: v1(181.74,23.76) 129.67,23.76 125.09,19.19 123.32,19.19 v1(114.94,27.57) ; NOREF#41.PTH v1(214.5,43.33)
  Bottom Layer w0.254: U1.10 113.12,29.39 v1(114.94,27.57) ; NOREF#31.PTH 189.1,23.76 v1(181.74,23.76) ; U6#10.1 214.5,58.58 v1(214.5,43.33)
BUTTON1: length 42.1
  Top Layer w0.254: v1(106.87,42) 109.15,39.72 v1(114.74,39.72)
  Bottom Layer w0.254: U1.5 101.99,42 v1(106.87,42) ; U6#5.1 132.77,21.68 v1(114.74,39.72)
BUTTON2: length 69
  Top Layer w0.254: v1(105.21,38.53) 106.73,37.01 114.61,37.01 135.18,57.58 v1(143.56,57.58)
  Bottom Layer w0.254: U1.7 103.69,37.01 v1(105.21,38.53) ; v1(143.56,57.58) 144.07,57.58 152.45,65.96 152.45,71.03 U6.1
D+: length 82.1
  Bottom Layer w0.254: NOREF#33.PTH 19.43,83.68 20.7,84.95 25.78,84.95 42.55,68.19 85.22,68.19 88.27,65.14 89.79,65.14 90.81,66.16 NOREF#7.PTH
D-: length 80.9
  Bottom Layer w0.254: NOREF#26.PTH 22.35,82.16 22.35,81.39 37.08,66.66 86.11,66.66 88.14,64.63 90.68,64.63 92.71,66.66 NOREF#38.PTH
DOWN: length 75.5
  Top Layer w0.254: v1(93.4,85.05) 93.4,82.77 89.85,79.21 89.85,38.57 82.99,31.71 v1(82.99,17.94)
  Bottom Layer w0.254: U6#3.1 94.67,86.32 v1(93.4,85.05) ; v1(82.99,17.94) U1.26
G: length 80.8
  Bottom Layer w0.254: NOREF#40.PTH 19.05,85.46 26.67,85.46 43.43,68.69 87.5,68.69 NOREF#55.PTH
L3: length 109.6
  Top Layer w0.254: NOREF#13.1 7.86,90.32 79.74,18.44 79.74,13.61 v1(80.5,12.85)
  Bottom Layer w0.254: v1(80.5,12.85) 80.5,12.84 U1.24
LB: length 199.2
  Top Layer w0.254: NOREF#45.PTH v1(233.3,66.28)
  Bottom Layer w0.254: v1(233.3,66.28) 251.08,84.06 257.43,84.06 259.21,82.28 261.7,82.28 U6#13.1 ; U1.17 101.52,11.61 100,10.08 100,8.05 100.25,7.8 121.08,7.8 121.59,7.29 165.69,7.29 168.28,9.88 168.28,11.15 181.48,24.36 188.09,24.36 NOREF#44.PTH
LED1: length 64.4
  Top Layer w0.254: v1(62.64,79.72) 67.76,74.6 67.76,38.78 v1(71.32,35.23)
  Bottom Layer w0.254: v1(62.64,79.72) U5#2.4 ; U1.29 81.23,24.31 71.32,34.21 v1(71.32,35.23)
LEFT: length 73.8
  Top Layer w0.254: v1(81.73,20.4) 81.59,20.54 81.59,74.89 v1(70.16,86.32)
  Bottom Layer w0.254: v1(70.16,86.32) 69.91,86.58 U6#2.1 ; v1(81.73,20.4) U1.27
LINEBUTTON01: length 52.9
  Top Layer w0.254: NOREF#35.1 v1(65.47,66.03)
  Bottom Layer w0.254: v1(65.47,66.03) 72.33,66.03 84.26,54.09 84.26,39.1 82.17,37.01 U1.34
LINEBUTTON02: length 43.6
  Top Layer w0.254: v1(83.57,33.26) 82.04,34.79 82.04,70.6 NOREF#51.1
  Bottom Layer w0.254: U1.32 83.07,33.26 v1(83.57,33.26)
LINEBUTTON03: length 58.8
  Top Layer w0.254: v1(83.95,31.61) 90.3,37.96 90.3,77.84 NOREF#2.1
  Bottom Layer w0.254: U1.31 82.23,29.39 83.95,31.1 v1(83.95,31.61)
LT: length 191
  Top Layer w0.254: NOREF#10.PTH 182.5,23.1 129.67,23.1 125.09,18.53 112.4,18.53 v1(106.62,24.31)
  Bottom Layer w0.254: U6#14.1 268.16,52.35 233.04,17.24 195.71,17.24 NOREF#56.PTH ; v1(106.62,24.31) U1.12
R3: length 102.4
  Top Layer w0.254: NOREF#19.1 24.38,84.57 24.38,76.44 80.52,20.31 v1(80.52,15.36)
  Bottom Layer w0.254: v1(80.52,15.36) U1.25
RB: length 171.8
  Top Layer w0.254: v1(236.6,70.44) 236.6,68.66 v1(206.12,38.18) ; NOREF#53.PTH 184.53,24.95 125.86,24.95 v1(124.84,23.94)
  Bottom Layer w0.254: v1(236.6,70.44) 236.6,86.39 U6#11.1 ; v1(206.12,38.18) 205.61,37.67 200.53,37.67 NOREF#11.PTH ; v1(124.84,23.94) 123.82,22.92 119.51,22.92 110.73,14.15 U1.16
RIGHT: length 56.9
  Top Layer w0.254: v1(118.17,78.32) 115.12,78.32 113.85,79.59 111.56,79.59 108.77,76.8 108.77,76.04 v1(104.2,71.47)
  Bottom Layer w0.254: v1(118.17,78.32) 119.18,78.32 U6#4.1 ; U1.6 101.57,39.55 99.88,41.24 99.88,67.15 v1(104.2,71.47)
RT: length 159.1
  Top Layer w0.254: v1(123.82,23.92) 124.59,23.16 125.35,23.16 126.62,24.43 184.28,24.43 NOREF#9.PTH ; NOREF#47.PTH 228.73,53.4 235.33,53.4 v1(237.36,55.43)
  Bottom Layer w0.254: v1(123.82,23.92) 120.9,26.85 U1.11 ; v1(237.36,55.43) 238.03,55.43 U6#12.1
SELECT: length 108.2
  Top Layer w0.254: NOREF#34.1 66.67,53.33 66.67,35.04 v1(79.63,22.09)
  Bottom Layer w0.254: U1.21 81.67,4.05 81.41,4.05 79.63,5.83 v1(79.63,22.09)
START: length 100.7
  Top Layer w0.254: v1(81.73,7.79) 81.12,8.4 81.12,21.86 67.18,35.8 67.18,62.73 40.51,89.4 NOREF#17.1
  Bottom Layer w0.254: v1(81.73,7.79) U1.22
UP: length 93.8
  Top Layer w0.254: v1(103.18,43.36) 103.18,26.85 112.07,17.96 127.31,17.96 128.32,16.94 160.58,16.94 162.36,18.72 v1(163.63,18.72)
  Bottom Layer w0.254: v1(163.63,18.72) 166.17,18.72 167.95,16.94 170.32,16.94 U6#6.1 ; U1.4 v1(103.18,43.36)
V: length 80.9
  Top Layer w0.254: v1(89.15,69.2) 87.38,67.42 v1(85.09,67.42)
  Bottom Layer w0.254: v1(89.15,69.2) 89.15,69.46 90.17,70.47 93.22,70.47 94.49,69.2 94.49,67.3 NOREF#22.PTH ; v1(85.09,67.42) 39.88,67.42 NOREF#58.PTH
X: length 108.6
  Top Layer w0.254: v1(120.7,26.08) v1(142.8,48.18)
  Bottom Layer w0.254: v1(142.8,48.18) 174.04,79.42 178.36,79.42 179.63,78.15 181.88,78.15 U6#7.1 ; U1.14 103.69,19.23 110.8,26.34 120.45,26.34 v1(120.7,26.08)
Y: length 154.2
  Top Layer w0.254: NOREF#27.PTH 203.84,45.13 203.84,53 204.09,53.25 204.09,54.78 203.84,55.03 203.84,61.38 v1(206.88,64.43) ; NOREF#29.PTH 180.97,25.55 124.59,25.55 v1(122.81,23.77)
  Bottom Layer w0.254: v1(206.88,64.43) 206.88,83.22 U6#9.1 ; U1.15 102.14,16.92 102.49,16.92 109.35,23.77 v1(122.81,23.77)

## Copper pours and planes (outline as drawn; the poured copper is in the pictures)
GND on Top Layer: 192.53,97.4 288.8,97.4 288.8,-1.92 192.53,-1.92
GND on Top Layer: -1.78,98.67 94.49,98.67 94.49,-1.28 -1.78,-1.28
GND on Top Layer: 96.9,97.52 191.52,97.52 191.52,-0.52 96.9,-0.52

## Text on the board
Bottom Layer: G | D+ | D- | V | led23 | led22 | ci01 | gnd | 3.3v | led21 | ci02 | vcc | led3 | ci03 | led20 | led19 | led18 | led8 | Y | RB | LB | B | RT | LT | led17 | led16 | led14 | led15 | led | Hitboard - GH60 / Designed by 搅局
Top Layer: L3 | R3 | SELECT | START
